# EAGLE design ESP-01 Test ver B (EAGLE 7.4.0)
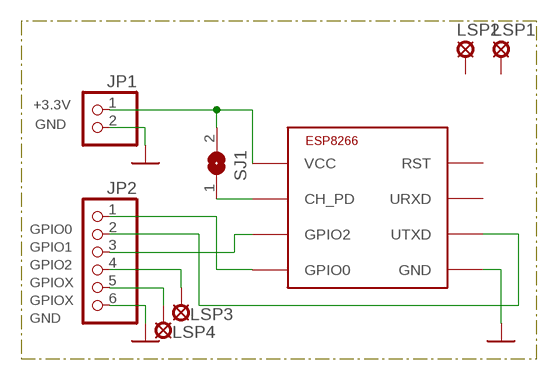
[diagram p0: schematic, sheet 1]

## Parts
JP1  PINHD-1X2  [1X02]
JP2  PINHD-1X6  [1X06]
LSP1  SE14  [SE14]
LSP2  SE14  [SE14]
LSP3  LSP10  [LSP10]
LSP4  LSP10  [LSP10]
SJ1  SJ  [SJ]
U$1  ESP8266-01  [ESP-01]

## Nets
GND: JP1.2 JP2.6 U$1.P$8(GND)
N$1: JP2.2 U$1.P$1(UTXD)
N$2: SJ1.1 U$1.P$2(CH_PD)
N$3: JP1.1 SJ1.2 U$1.P$4(VCC)
N$4: JP2.3 U$1.P$7(GPIO2)
N$5: JP2.1 U$1.P$6(GPIO0)
N$6: JP2.5 LSP4.MP
N$7: JP2.4 LSP3.MP
Unconnected: LSP1.MP LSP2.MP U$1.P$3(RST) U$1.P$5(URXD)

## Notes on the sheet
- +3.3V
- GND
- GPIO0
- GPIO1
- GPIO2
- GPIOX
- GPIOX
- GND

## Library data of the parts
JP1 = pinhead:PINHD-1X2: PIN HEADER
JP2 = pinhead:PINHD-1X6: PIN HEADER
LSP1 LSP2 = solpad:SE14: SOLDER PAD E1553, drill 1,4mm, distributor Buerklin, 07F820
LSP3 LSP4 = solpad:LSP10: SOLDER PAD drill 1.0 mm, distributor Buerklin, 12H555
SJ1 = jumper:SJ: SMD solder JUMPER
U$1 = #ESP8266:ESP8266-01: ESP8266 - ESP-01 Module

## Board
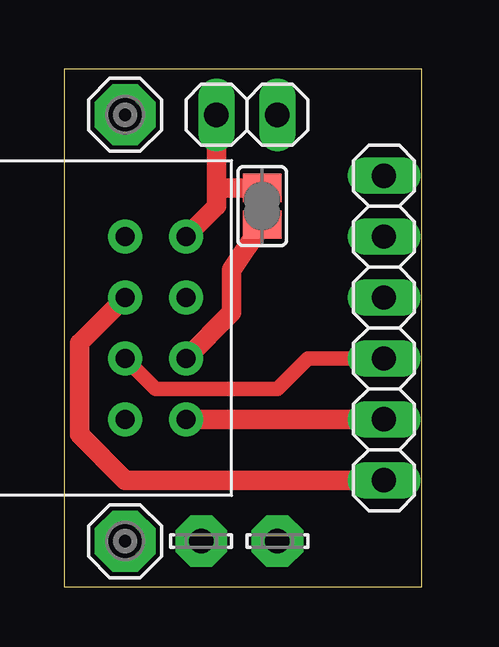
[diagram p1: board, top side]
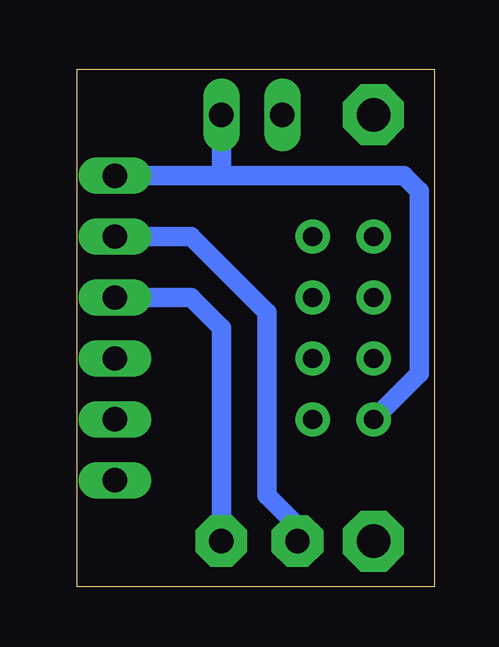
[diagram p2: board, bottom side, seen from below]

Size 14.91 x 21.58 mm. Coordinates in mm from the lower left corner, seen from the top.
Outline: 0,0 14.91,0 14.91,21.58 0,21.58 0,0
Copper layers (1*16): Top 0.035mm / dielectric 1.5mm / Bottom 0.035mm
Design rules "default": minimum track width 10mil, minimum drill 24mil, track to track 8mil, track to pad 8mil, pad to pad 8mil, via to via 8mil, smd to smd 8mil, copper to edge 40mil, drill to drill 8mil, minimum pad ring 10mil, minimum via ring 8mil, stop-mask expansion 4mil, vias tented up to drill 0mil, thermal gap 10mil

### Footprints (pad centres in the part's own frame; a part is rotated, then mirrored left to right if it is on the bottom)
1X02 = drill 1.016 long: 1 -1.27,0; 2 1.27,0
1X06 = drill 1.016 long: 1 -6.35,0; 2 -3.81,0; 3 -1.27,0; 4 1.27,0; 5 3.81,0; 6 6.35,0
SE14 = drill 1.397 pad 2.54 octagon: MP 0,0
LSP10 = drill 1.016 pad 2.159 octagon: MP 0,0
SJ = smd 1.168 x 1.6: 1 -0.762,0; 2 0.762,0
ESP-01 = drill 0.8 pad 1.422: P$1 0,0; P$2 2.54,0; P$3 5.08,0; P$4 7.62,0; P$5 7.62,2.54; P$6 5.08,2.54; P$7 2.54,2.54; P$8 0,2.54

### Placement (x,y rotation side)
JP1  7.62,19.68 0 top
JP2  13.34,10.79 90 top
LSP1  2.54,1.91 0 top
LSP2  2.54,19.68 0 top
LSP3  8.89,1.91 0 top
LSP4  5.71,1.91 0 top
SJ1  8.26,15.88 90 top
U$1  5.08,6.99 90 top

### Tracks (layer width: path | path; a pad name or v marks a point on that pad's centre or on a via)
GND
  Bottom 0.813: JP1.2 8.89,17.14 JP2.6 1.27,17.14 0.64,16.51 0.64,8.89 U$1.P$8
N$1
  Top 0.813: U$1.P$1 JP2.2
N$2
  Top 0.813: U$1.P$2 6.99,11.43 6.99,13.21 SJ1.1
N$3
  Top 0.813: U$1.P$4 6.35,15.88 6.35,16.64 | JP1.1 6.35,16.64 | 6.35,16.64 SJ1.2
N$4
  Top 0.61: U$1.P$7 3.81,8.26 8.89,8.26 10.16,9.53 JP2.3
N$5
  Top 0.813: U$1.P$6 0.64,10.16 0.64,6.35 2.54,4.45 JP2.1
N$6
  Bottom 0.813: LSP4.MP 5.71,2.54 6.99,3.81 6.99,11.43 10.16,14.61 JP2.5
N$7
  Bottom 0.813: LSP3.MP 8.89,10.79 10.16,12.06 JP2.4

### Text on the board
tValues: GND | GND | GND | GND | GND | GND